# Altium schematic sheet Sheet3.SchDoc
size A
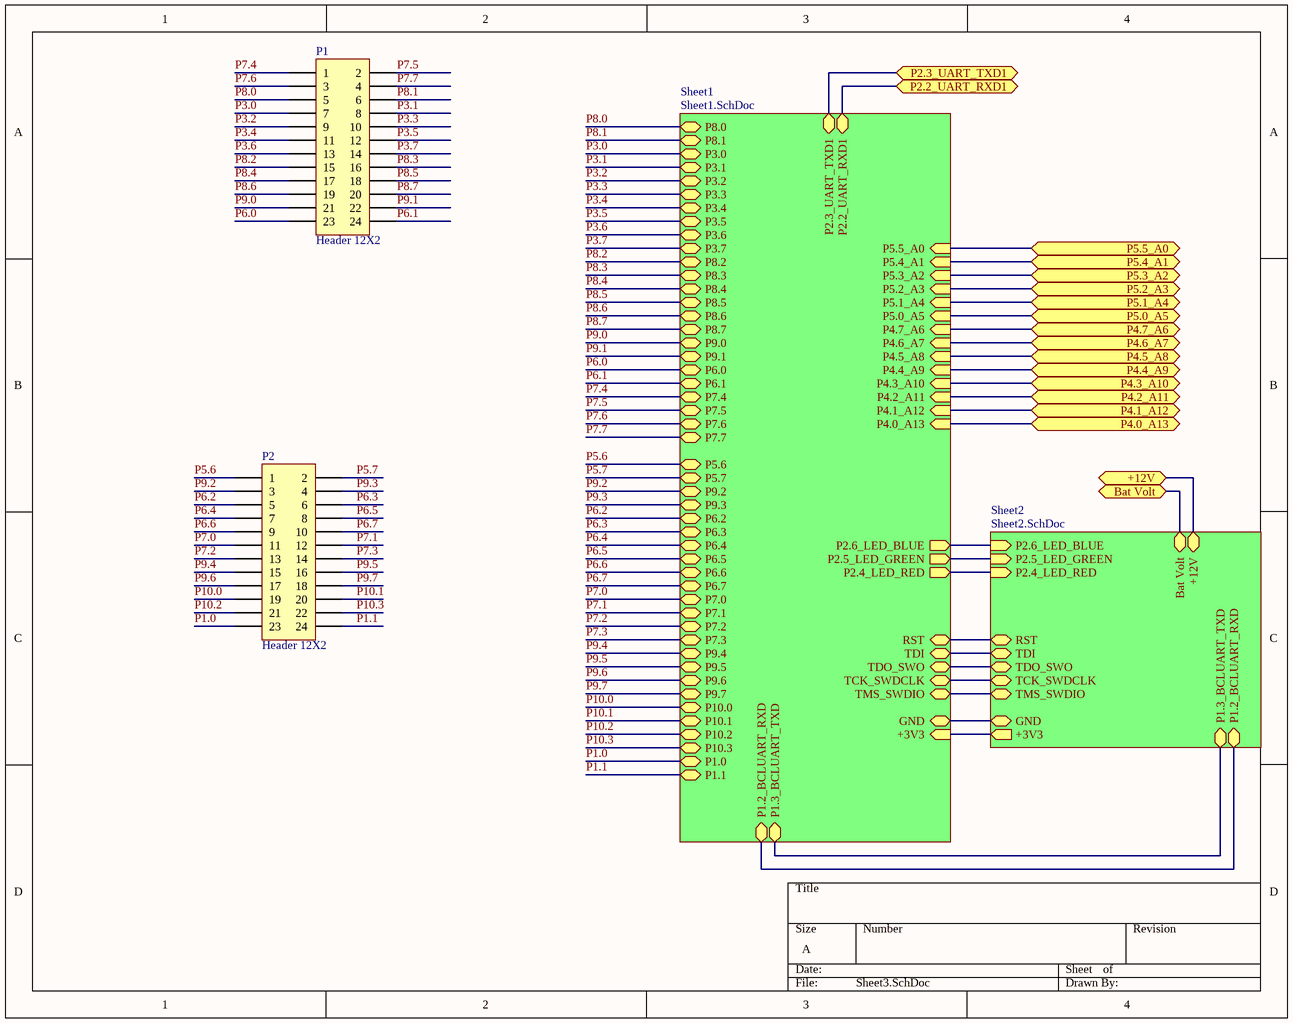
[diagram p0: Sheet3.SchDoc]

## Parts
P1  Header 12X2  [HDR2X12]
P2  Header 12X2  [HDR2X12]

## Sub-sheets
Sheet1 = Sheet1.SchDoc: +3V3 (in), GND, RST, P2.4_LED_RED (out), P2.6_LED_BLUE (out), P2.5_LED_GREEN (out), TDI, TDO_SWO, TCK_SWDCLK, TMS_SWDIO, P1.2_BCLUART_RXD, P1.3_BCLUART_TXD, P4.0_A13 (in), P4.1_A12 (in), P4.2_A11 (in), P4.3_A10 (in), P4.4_A9 (in), P4.5_A8 (in), P4.6_A7 (in), P4.7_A6 (in), P5.0_A5 (in), P5.1_A4 (in), P5.2_A3 (in), P5.3_A2 (in), P5.4_A1 (in), P5.5_A0 (in), P2.2_UART_RXD1, P2.3_UART_TXD1, P8.3, P8.4, P8.5, P8.6, P8.7, P9.1, P9.0, P6.0, P6.1, P3.3, P3.4, P3.1, P3.2, P3.0, P8.2, P3.7, P3.5, P3.6, P8.1, P8.0, P7.4, P7.6, P7.5, P7.7, P5.6, P5.7, P9.2, P9.3, P6.2, P6.3, P6.4, P6.5, P6.6, P6.7, P7.0, P7.1, P7.2, P7.3, P9.4, P9.5, P9.6, P9.7, P10.0, P10.1, P10.2, P10.3, P1.0, P1.1
Sheet2 = Sheet2.SchDoc: +3V3 (out), GND, RST, P2.4_LED_RED (in), P2.5_LED_GREEN (in), P2.6_LED_BLUE (in), TDI, TDO_SWO, TCK_SWDCLK, TMS_SWDIO, P1.2_BCLUART_RXD, P1.3_BCLUART_TXD, Bat Volt, +12V

## Ports
+12V, Bat Volt, P2.2_UART_RXD1, P2.3_UART_TXD1, P4.0_A13, P4.1_A12, P4.2_A11, P4.3_A10, P4.4_A9, P4.5_A8, P4.6_A7, P4.7_A6, P5.0_A5, P5.1_A4, P5.2_A3, P5.3_A2, P5.4_A1, P5.5_A0

## Nets
+12V: port +12V, sheet Sheet2/+12V
Bat Volt: port Bat Volt, sheet Sheet2/Bat Volt
P1.0: P2.23 ; sheet Sheet1/P1.0
P1.1: P2.24 ; sheet Sheet1/P1.1
P2.2_UART_RXD1: port P2.2_UART_RXD1, sheet Sheet1/P2.2_UART_RXD1
P2.3_UART_TXD1: port P2.3_UART_TXD1, sheet Sheet1/P2.3_UART_TXD1
P3.0: P1.7 ; sheet Sheet1/P3.0
P3.1: P1.8 ; sheet Sheet1/P3.1
P3.2: P1.9 ; sheet Sheet1/P3.2
P3.3: P1.10 ; sheet Sheet1/P3.3
P3.4: P1.11 ; sheet Sheet1/P3.4
P3.5: P1.12 ; sheet Sheet1/P3.5
P3.6: P1.13 ; sheet Sheet1/P3.6
P3.7: P1.14 ; sheet Sheet1/P3.7
P4.0_A13: port P4.0_A13, sheet Sheet1/P4.0_A13
P4.1_A12: port P4.1_A12, sheet Sheet1/P4.1_A12
P4.2_A11: port P4.2_A11, sheet Sheet1/P4.2_A11
P4.3_A10: port P4.3_A10, sheet Sheet1/P4.3_A10
P4.4_A9: port P4.4_A9, sheet Sheet1/P4.4_A9
P4.5_A8: port P4.5_A8, sheet Sheet1/P4.5_A8
P4.6_A7: port P4.6_A7, sheet Sheet1/P4.6_A7
P4.7_A6: port P4.7_A6, sheet Sheet1/P4.7_A6
P5.0_A5: port P5.0_A5, sheet Sheet1/P5.0_A5
P5.1_A4: port P5.1_A4, sheet Sheet1/P5.1_A4
P5.2_A3: port P5.2_A3, sheet Sheet1/P5.2_A3
P5.3_A2: port P5.3_A2, sheet Sheet1/P5.3_A2
P5.4_A1: port P5.4_A1, sheet Sheet1/P5.4_A1
P5.5_A0: port P5.5_A0, sheet Sheet1/P5.5_A0
P5.6: P2.1 ; sheet Sheet1/P5.6
P5.7: P2.2 ; sheet Sheet1/P5.7
P6.0: P1.23 ; sheet Sheet1/P6.0
P6.1: P1.24 ; sheet Sheet1/P6.1
P6.2: P2.5 ; sheet Sheet1/P6.2
P6.3: P2.6 ; sheet Sheet1/P6.3
P6.4: P2.7 ; sheet Sheet1/P6.4
P6.5: P2.8 ; sheet Sheet1/P6.5
P6.6: P2.9 ; sheet Sheet1/P6.6
P6.7: P2.10 ; sheet Sheet1/P6.7
P7.0: P2.11 ; sheet Sheet1/P7.0
P7.1: P2.12 ; sheet Sheet1/P7.1
P7.2: P2.13 ; sheet Sheet1/P7.2
P7.3: P2.14 ; sheet Sheet1/P7.3
P7.4: P1.1 ; sheet Sheet1/P7.4
P7.5: P1.2 ; sheet Sheet1/P7.5
P7.6: P1.3 ; sheet Sheet1/P7.6
P7.7: P1.4 ; sheet Sheet1/P7.7
P8.0: P1.5 ; sheet Sheet1/P8.0
P8.1: P1.6 ; sheet Sheet1/P8.1
P8.2: P1.15 ; sheet Sheet1/P8.2
P8.3: P1.16 ; sheet Sheet1/P8.3
P8.4: P1.17 ; sheet Sheet1/P8.4
P8.5: P1.18 ; sheet Sheet1/P8.5
P8.6: P1.19 ; sheet Sheet1/P8.6
P8.7: P1.20 ; sheet Sheet1/P8.7
P9.0: P1.21 ; sheet Sheet1/P9.0
P9.1: P1.22 ; sheet Sheet1/P9.1
P9.2: P2.3 ; sheet Sheet1/P9.2
P9.3: P2.4 ; sheet Sheet1/P9.3
P9.4: P2.15 ; sheet Sheet1/P9.4
P9.5: P2.16 ; sheet Sheet1/P9.5
P9.6: P2.17 ; sheet Sheet1/P9.6
P9.7: P2.18 ; sheet Sheet1/P9.7
P10.0: P2.19 ; sheet Sheet1/P10.0
P10.1: P2.20 ; sheet Sheet1/P10.1
P10.2: P2.21 ; sheet Sheet1/P10.2
P10.3: P2.22 ; sheet Sheet1/P10.3
(unnamed): sheet Sheet1/+3V3, sheet Sheet2/+3V3
(unnamed): sheet Sheet1/GND, sheet Sheet2/GND
(unnamed): sheet Sheet1/RST, sheet Sheet2/RST
(unnamed): sheet Sheet1/P2.4_LED_RED, sheet Sheet2/P2.4_LED_RED
(unnamed): sheet Sheet1/P2.6_LED_BLUE, sheet Sheet2/P2.6_LED_BLUE
(unnamed): sheet Sheet1/P2.5_LED_GREEN, sheet Sheet2/P2.5_LED_GREEN
(unnamed): sheet Sheet1/TDI, sheet Sheet2/TDI
(unnamed): sheet Sheet1/TDO_SWO, sheet Sheet2/TDO_SWO
(unnamed): sheet Sheet1/TCK_SWDCLK, sheet Sheet2/TCK_SWDCLK
(unnamed): sheet Sheet1/TMS_SWDIO, sheet Sheet2/TMS_SWDIO
(unnamed): sheet Sheet1/P1.2_BCLUART_RXD, sheet Sheet2/P1.2_BCLUART_RXD
(unnamed): sheet Sheet1/P1.3_BCLUART_TXD, sheet Sheet2/P1.3_BCLUART_TXD

## Library data of the parts
P1 P2 = Header 12X2: Header, 12-Pin, Dual row; LatestRevisionDate: 17-Jul-2002; LatestRevisionNote: Re-released for DXP Platform.; Publisher: Altium Limited